# Altium schematic sheet audio.SchDoc
size A
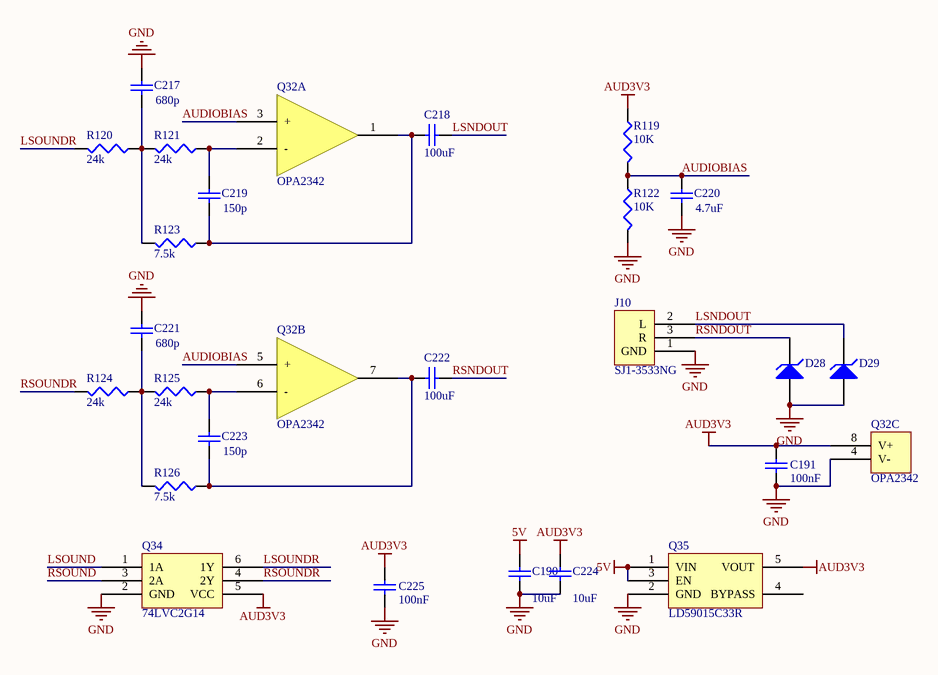
[diagram p0: audio.SchDoc]

## Parts
C190  value 10uF  [CAPC1608X90N]  (hidden comment: GRM188R60G106ME47)
C191  value 100nF  [CAPC1005X06L]  (hidden comment: Cap)
C217  value 680p  [CAPC1608X90N]
C218  value 100uF  [CAPC3225X220N]  (hidden comment: GRM31CR60J107ME39L)
C219  value 150p  [CAPC1608X90N]
C220  value 4.7uF  [CAPC1608X90N]  (hidden comment: GRM188R60J475ME19D)
C221  value 680p  [CAPC1608X90N]
C222  value 100uF  [CAPC3225X220N]  (hidden comment: GRM31CR60J107ME39L)
C223  value 150p  [CAPC1608X90N]
C224  value 10uF  [CAPC1608X90N]  (hidden comment: GRM188R60G106ME47)
C225  value 100nF  [CAPC1005X06L]  (hidden comment: Cap)
D28  EZAEG2A  [CAPC1005X55N]  (value not drawn)
D29  EZAEG2A  [CAPC1005X55N]  (value not drawn)
J10  SJ1-3533NG  [SJ1-3533NG]
Q32  OPA2342  [SOIC127P600X175-8AN]  (parts A,B,C of 3)
Q34  74LVC2G14  [74LVC2G14-SOP6]
Q35  LD59015C33R  [SOT23-5]
R119  value 10K  [J1-0603]  (hidden comment: RC1608F103CS)
R120  value 24k  [J1-0603]  (hidden comment: RC1608F471CS)
R121  value 24k  [J1-0603]  (hidden comment: RC1608F471CS)
R122  value 10K  [J1-0603]  (hidden comment: RC1608F103CS)
R123  value 7.5k  [J1-0603]  (hidden comment: RC1608F471CS)
R124  value 24k  [J1-0603]  (hidden comment: RC1608F471CS)
R125  value 24k  [J1-0603]  (hidden comment: RC1608F471CS)
R126  value 7.5k  [J1-0603]  (hidden comment: RC1608F471CS)

## Nets
5V: C190.2 Q35.1(VIN) Q35.3(EN)
AUD3V3: C191.2 C224.2 C225.2 Q32.8(V+) Q34.5(VCC) Q35.5(VOUT) R119.1
GND: C190.1 C191.1 C217.2 C220.1 C221.2 C224.1 C225.1 D28.1(A) D29.1(A) J10.1(GND) Q32.4(V-) Q34.2(GND) Q35.2(GND) R122.2
AUDIOBIAS: C220.2 Q32.3(+) Q32.5(+) R119.2 R122.1
LSNDOUT: C218.2 D29.2(K) J10.2(L)
LSOUND: Q34.1(1A)
LSOUNDR: Q34.6(1Y) R120.2
RSNDOUT: C222.2 D28.2(K) J10.3(R)
RSOUND: Q34.3(2A)
RSOUNDR: Q34.4(2Y) R124.2
NetC217_1: C217.1 R120.1 R121.2 R123.2
NetC218_1: C218.1 C219.1 Q32.1 R123.1
NetC219_2: C219.2 Q32.2(-) R121.1
NetC221_1: C221.1 R124.1 R125.2 R126.2
NetC222_1: C222.1 C223.1 Q32.7 R126.1
NetC223_2: C223.2 Q32.6(-) R125.1

Not connected (* = marked no-connect by the designer): Q35 4(BYPASS)

## Library data of the parts
C190 C191 C217-C225 = Cap: Capacitor; Published: 8-Jun-2000; LatestRevisionDate: 17-Jul-2002; LatestRevisionNote: Re-released for DXP Platform.; PackageReference: RAD-0.3; Publisher: Altium Limited; PackageDescription: Radial Cap, Thru-Hole; 2 Leads; 0.3 in Pin Spacing; Supplier 1: Digi-Key
  C190 C224: Supplier Part Number 1: 490-3298-1-ND
  C191 C225: Supplier Part Number 1: 1276-1443-1-ND
  C217 C221: Supplier Part Number 1: PCF1451CT-ND
  C218 C222: Supplier Part Number 1: 718-1920-1-ND
  C219 C223: Supplier Part Number 1: PCF1443CT-ND
  C220: Supplier Part Number 1: 490-5421-1-ND
D28 D29 = D Zener: Zener Diode; Published: 8-Jun-2000; LatestRevisionDate: 17-Jul-2002; LatestRevisionNote: Re-released for DXP Platform.; PackageReference: DIODE-0.7; Publisher: Altium Limited; PackageDescription: Diode, Thru-Hole; 2 Leads; 0.7 in Pin Spacing; Supplier 1: Digi-Key; Supplier Part Number 1: P13571CT-ND
J10 = AUDIO: Supplier 1: Digi-Key; Supplier Part Number 1: CP1-3533NG-ND
Q32 = OPAMP: Supplier 1: Digi-Key; Supplier Part Number 1: OPA2342UA-ND
Q35 = LDO: Supplier 1: Digi-Key; Supplier Part Number 1: 497-10611-1-ND
R119-R126 = Res3: Resistor; Published: 8-Jun-2000; LatestRevisionDate: 29-May-2009; LatestRevisionNote: IPC-7351 Footprint Added.; PackageReference: J1-0603; Publisher: Altium Limited; PackageDescription: Chip Resistor; Supplier 1: Digi-Key
  R119 R122: Supplier Part Number 1: 1276-3485-1-ND
  R120 R121 R124 R125: Supplier Part Number 1: 1276-4777-1-ND
  R123 R126: Supplier Part Number 1: 1276-4732-1-ND
Q34 = 74LVC2G14: Supplier 1: Digi-Key; Supplier Part Number 1: 568-7780-1-ND